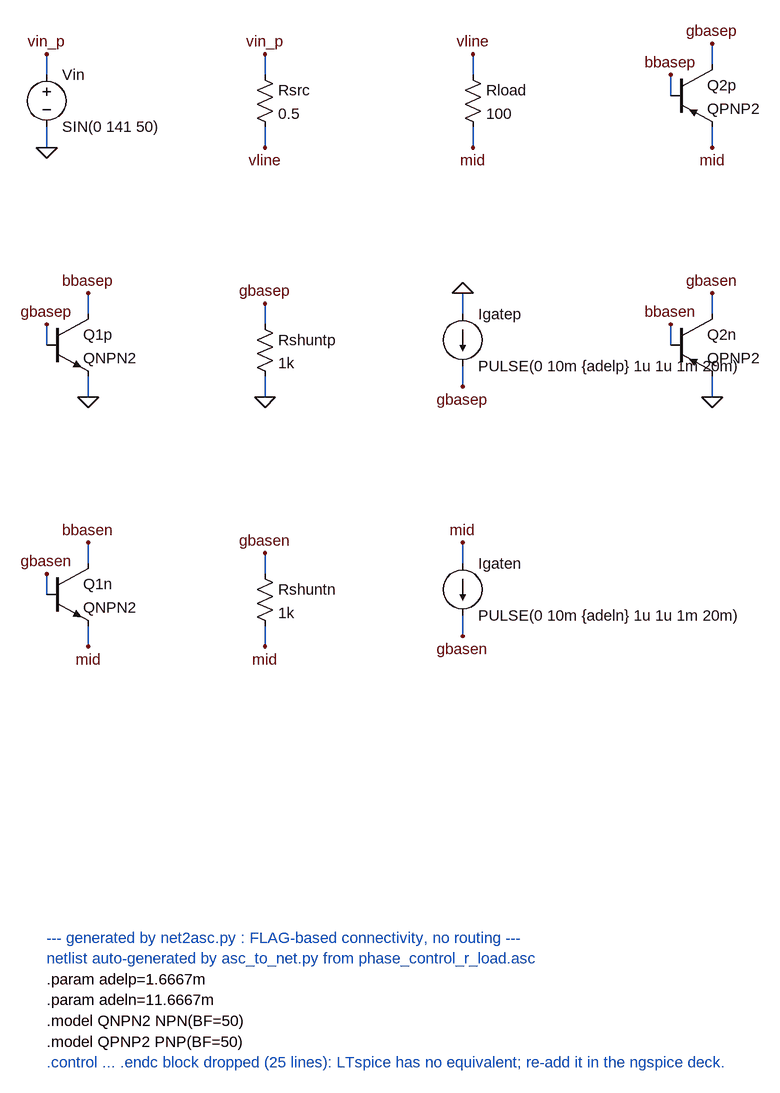
[diagram p0: schematic phase_control_r_load.asc]
phase_control_r_load.asc, the LTspice schematic file:
Version 4
SHEET 1 1424 1736
WIRE 0 16 0 -16
WIRE 0 96 0 128
WIRE 336 16 336 -16
WIRE 336 96 336 128
WIRE 656 16 656 -16
WIRE 656 96 656 128
WIRE 1024 0 1024 -32
WIRE 960 48 960 16
WIRE 1024 96 1024 128
WIRE 64 384 64 352
WIRE 0 432 0 400
WIRE 64 480 64 512
WIRE 336 400 336 368
WIRE 336 480 336 512
WIRE 640 384 640 352
WIRE 640 464 640 496
WIRE 1024 384 1024 352
WIRE 960 432 960 400
WIRE 1024 480 1024 512
WIRE 64 768 64 736
WIRE 0 816 0 784
WIRE 64 864 64 896
WIRE 336 784 336 752
WIRE 336 864 336 896
WIRE 640 768 640 736
WIRE 640 848 640 880
FLAG 0 -16 vin_p
FLAG 0 128 0
FLAG 336 -16 vin_p
FLAG 336 128 vline
FLAG 656 -16 vline
FLAG 656 128 mid
FLAG 1024 -32 gbasep
FLAG 960 16 bbasep
FLAG 1024 128 mid
FLAG 64 352 bbasep
FLAG 0 400 gbasep
FLAG 64 512 0
FLAG 336 368 gbasep
FLAG 336 512 0
FLAG 640 352 0
FLAG 640 496 gbasep
FLAG 1024 352 gbasen
FLAG 960 400 bbasen
FLAG 1024 512 0
FLAG 64 736 bbasen
FLAG 0 784 gbasen
FLAG 64 896 mid
FLAG 336 752 gbasen
FLAG 336 896 mid
FLAG 640 736 mid
FLAG 640 880 gbasen
SYMBOL voltage 0 0 R0
SYMATTR InstName Vin
SYMATTR Value SIN(0 141 50)
SYMBOL res 320 0 R0
SYMATTR InstName Rsrc
SYMATTR Value 0.5
SYMBOL res 640 0 R0
SYMATTR InstName Rload
SYMATTR Value 100
SYMBOL pnp 960 0 R0
SYMATTR InstName Q2p
SYMATTR Value QPNP2
SYMBOL npn 0 384 R0
SYMATTR InstName Q1p
SYMATTR Value QNPN2
SYMBOL res 320 384 R0
SYMATTR InstName Rshuntp
SYMATTR Value 1k
SYMBOL current 640 384 R0
SYMATTR InstName Igatep
SYMATTR Value PULSE(0 10m {adelp} 1u 1u 1m 20m)
SYMBOL pnp 960 384 R0
SYMATTR InstName Q2n
SYMATTR Value QPNP2
SYMBOL npn 0 768 R0
SYMATTR InstName Q1n
SYMATTR Value QNPN2
SYMBOL res 320 768 R0
SYMATTR InstName Rshuntn
SYMATTR Value 1k
SYMBOL current 640 768 R0
SYMATTR InstName Igaten
SYMATTR Value PULSE(0 10m {adeln} 1u 1u 1m 20m)
TEXT 0 1344 Left 2 ;--- generated by net2asc.py : FLAG-based connectivity, no routing ---
TEXT 0 1376 Left 2 ;netlist auto-generated by asc_to_net.py from phase_control_r_load.asc
TEXT 0 1408 Left 2 !.param adelp=1.6667m
TEXT 0 1440 Left 2 !.param adeln=11.6667m
TEXT 0 1472 Left 2 !.model QNPN2 NPN(BF=50)
TEXT 0 1504 Left 2 !.model QPNP2 PNP(BF=50)
TEXT 0 1536 Left 2 ;.control ... .endc block dropped (25 lines): LTspice has no equivalent; re-add it in the ngspice deck.

The netlist it stands for:
* phase_control_r_load.asc
Vin vin_p 0 SIN(0 141 50)
Rsrc vin_p vline 0.5
Rload vline mid 100
Q2p gbasep bbasep mid 0 QPNP2
Q1p bbasep gbasep 0 0 QNPN2
Rshuntp gbasep 0 1k
Igatep 0 gbasep PULSE(0 10m {adelp} 1u 1u 1m 20m)
Q2n gbasen bbasen 0 0 QPNP2
Q1n bbasen gbasen mid 0 QNPN2
Rshuntn gbasen mid 1k
Igaten mid gbasen PULSE(0 10m {adeln} 1u 1u 1m 20m)
.model NPN NPN
.model PNP PNP
.lib standard.bjt
* --- generated by net2asc.py : FLAG-based connectivity, no routing ---
* netlist auto-generated by asc_to_net.py from phase_control_r_load.asc
.param adelp=1.6667m
.param adeln=11.6667m
.model QNPN2 NPN(BF=50)
.model QPNP2 PNP(BF=50)
* .control ... .endc block dropped (25 lines): LTspice has no equivalent; re-add it in the ngspice deck.
.backanno
.end